# Altium schematic sheet ch340_usbc.SchDoc
size A; SheetNumber: 1; SheetTotal: 1
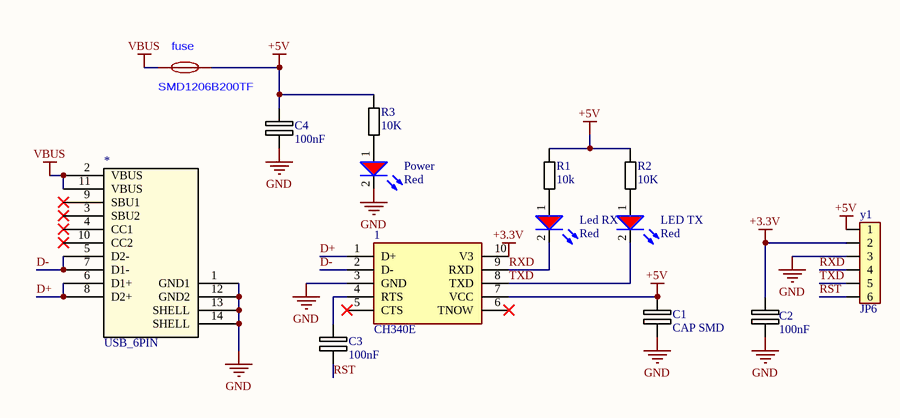
[diagram p0: ch340_usbc.SchDoc]

## Parts
1  CH340E  [ADS1115 SMD]
*  USB_6PIN  [USB-C-SMD_TYPE-C-6PIN-2MD-073]
C1  CAP SMD  [C-0805]
C2  100nF  [C-0805]
C3  100nF  [C-0805]
C4  100nF  [C-0805]
fuse  SMD1206B200TF  [F1206]
Led_RX  value Red  [Led 0805R]  (hidden comment: LED-0805RVC)
LED_TX  value Red  [Led 0805R]  (hidden comment: LED-0805RVC)
Power  LED-0805RVC  [Led 0805R]  (value not drawn)
R1  10k  [R0603]
R2  10K  [R0603]
R3  10K  [R0603]
y1  JP6  [JP6-D1T]

## Nets
+3.3V: 1.10(V3) C2.1(+) y1.2
+5V: 1.7(VCC) C1.2(-) C4.2(-) fuse.2 R1.2 R2.2 R3.2 y1.1
GND: 1.3(GND) *.1(GND1) *.12(GND2) *.13(SHELL) *.14(SHELL) C1.1(+) C2.2(-) C4.1(+) Power.2(K) y1.3
VBUS: *.2(VBUS) *.11(VBUS) fuse.1
D+: 1.1(D+) *.6(D1+) *.8(D2+)
D-: 1.2(D-) *.5(D2-) *.7(D1-)
RST: C3.1(+) y1.6
RXD: 1.9(RXD) Led_RX.2(K) y1.4
TXD: 1.8(TXD) LED_TX.2(K) y1.5
Net1_4: 1.4(RTS) C3.2(-)
NetLed_RX_1: Led_RX.1(A) R1.1
NetLED_TX_1: LED_TX.1(A) R2.1
NetPower_1: Power.1(A) R3.1

Not connected (* = marked no-connect by the designer): 1 5(CTS)* 6(TNOW)*; * 3(SBU2)* 4(CC1)* 9(SBU1)* 10(CC2)*

## Notes on the sheet
- (in symbol LED-0805RVC) Red

## Library data of the parts
C1-C4 = CAP SMD: Capacitor Polarised; Manufacturer_Name: AVX; Manufacturer_Part_Number: TAJC227K006RNJV; Datasheet Link: http://datasheets.avx.com/TAJ.pdf; Height: 2.8mm; Arrow Part Number: TAJC227K006RNJV; Arrow Price/Stock: https://www.arrow.com/en/products/tajc227k006rnjv/avx; Mouser Part Number: 581-TAJC227K006RNJV; Mouser Price/Stock: https://www.mouser.co.uk/ProductDetail/AVX/TAJC227K006RNJV?qs=k4kUdCzLgS5cVBAajWRJdQ%3D%3D
Led_RX LED_TX Power = LED-0805RVC: LED Red 2mA 1.8V 0805; ComponentLink1Description: Datasheet; ComponentLink1URL: D:\Dropbox\Datasheets\Opto and Illumination\LEDs\SMD LED.pdf; Unit Price: 0.0476
R1 = res_0603
R2 R3 = Resistor